# Altium project MiniPC MB GOST.PrjPcb (part 29 of 31)
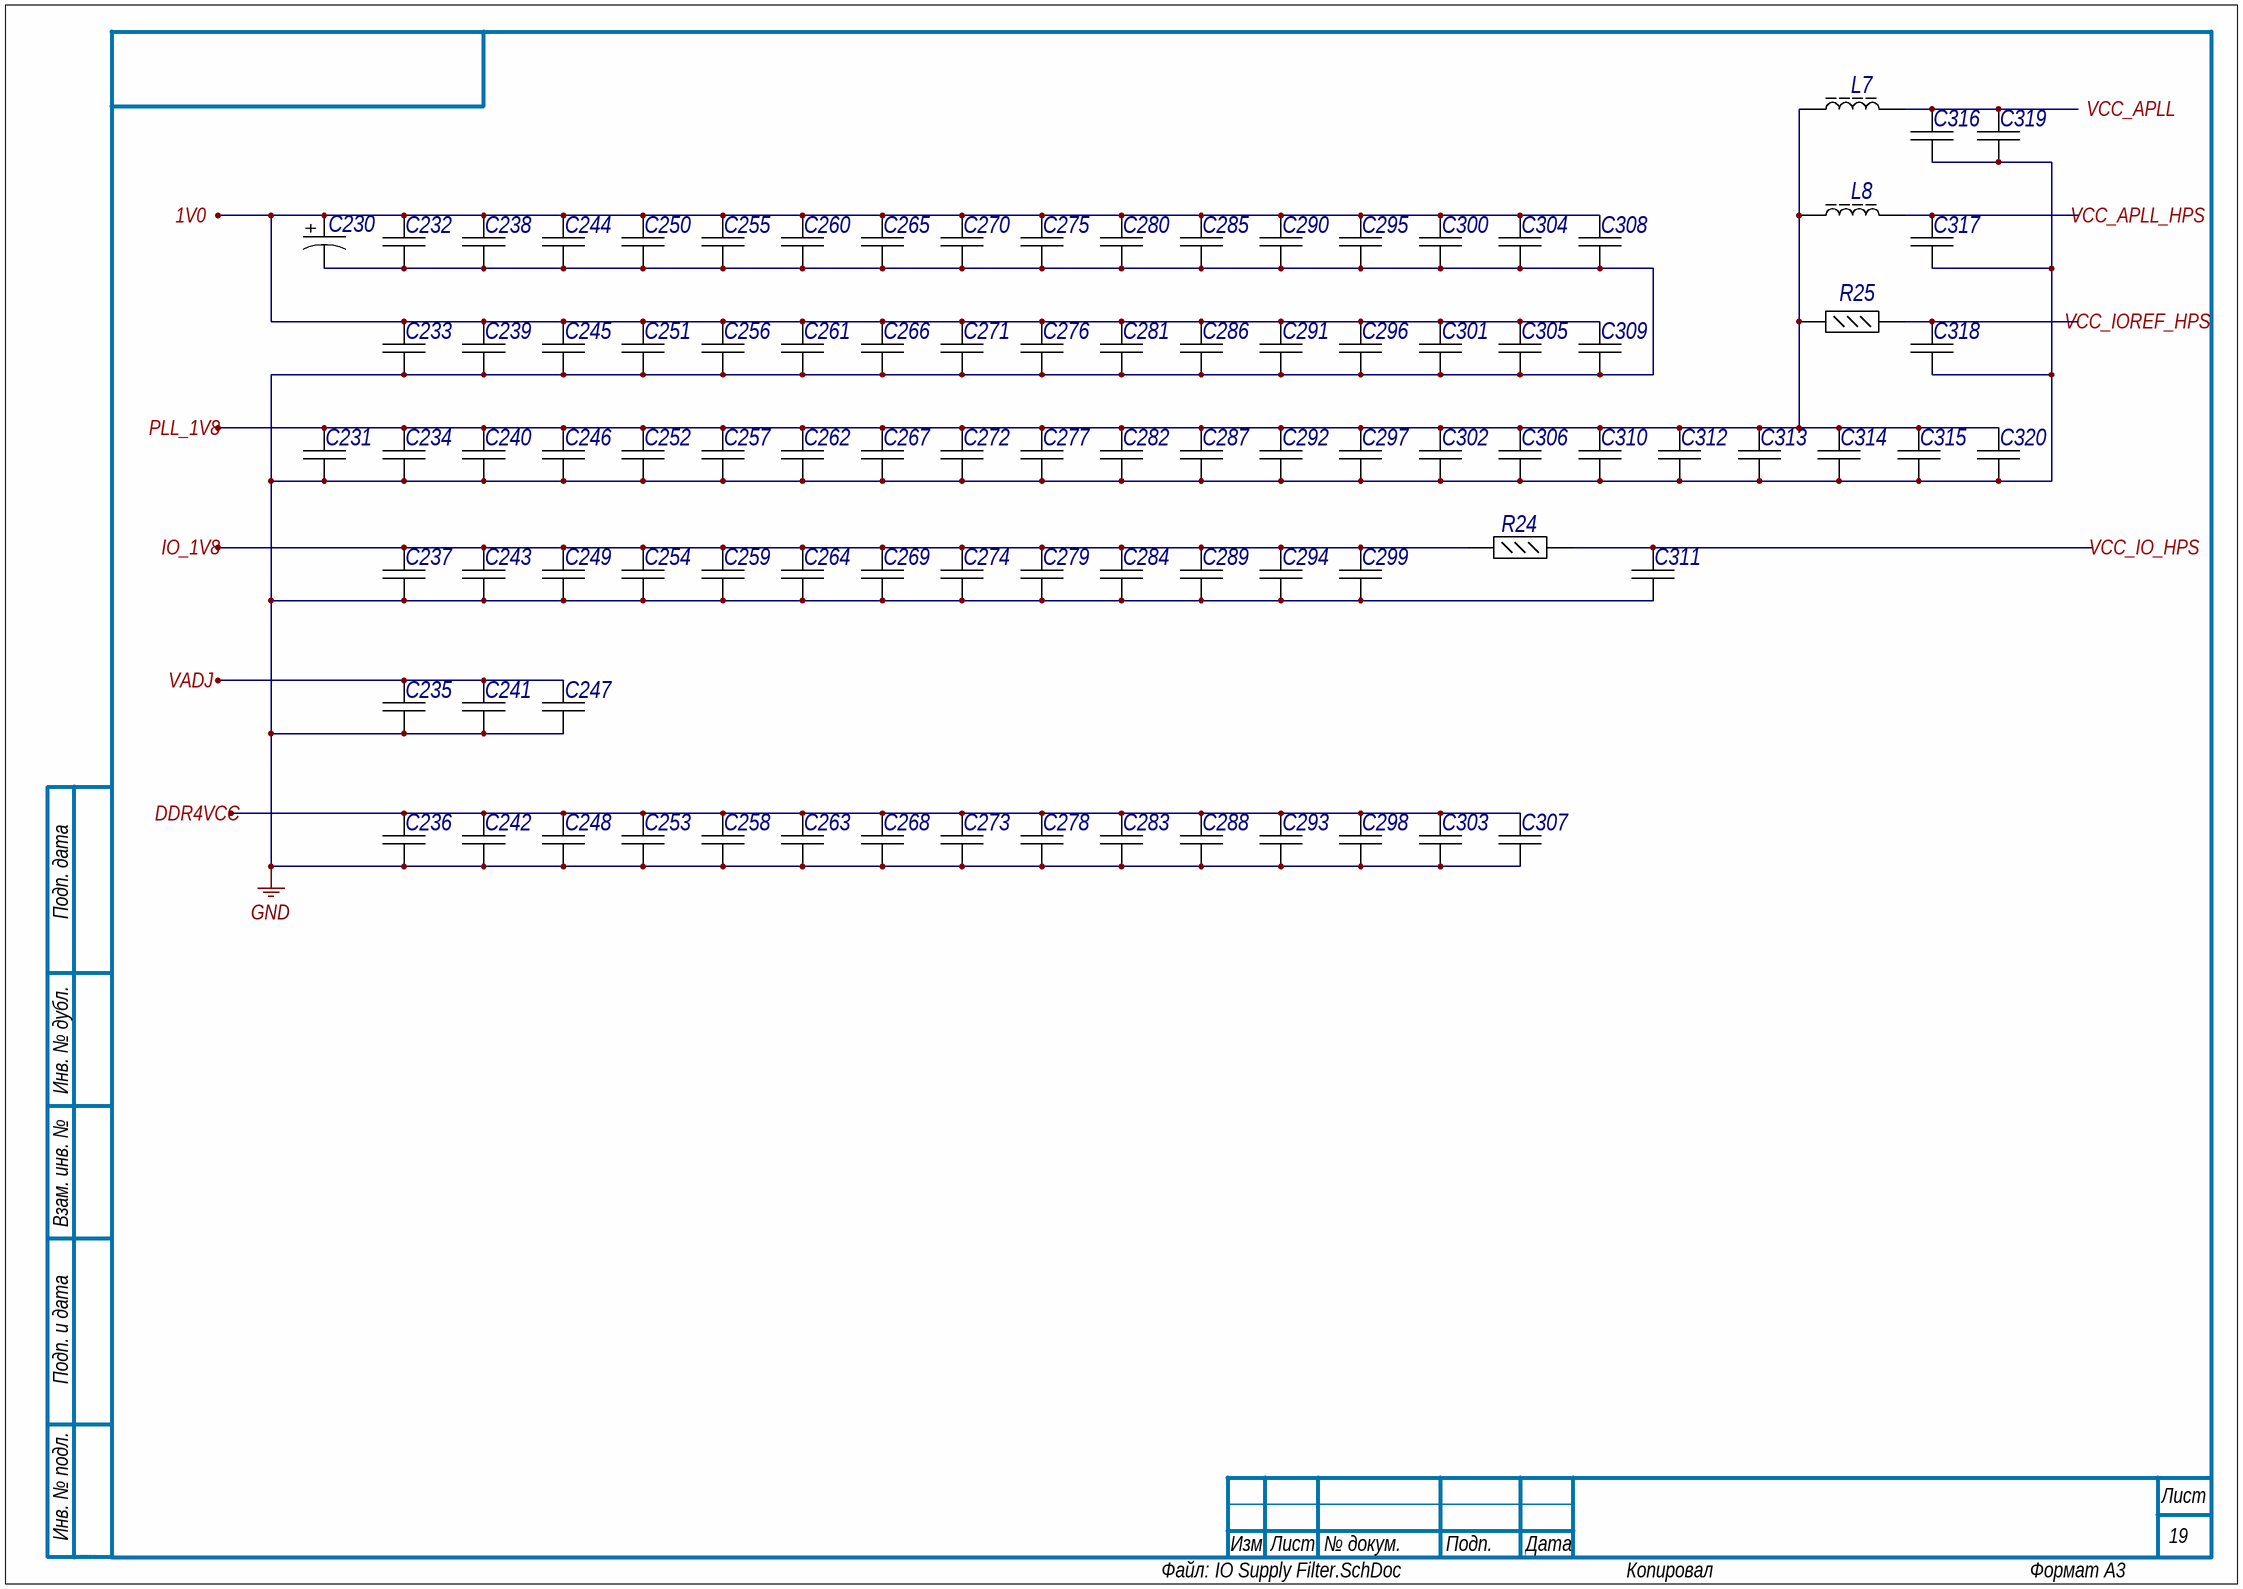
[diagram p56: IO Supply Filter.SchDoc]

## Sheet IO Supply Filter.SchDoc (continued)

### Library data of the parts (continued)
C275 = E22: Chip Capacitor, 100 nF, +/- 10%, 6.3 V, -55 to 85 degC, 0201 (0603 Metric), RoHS, Tape and Reel; Manufacturer: Basic Passives; Тип элемента: Конденсатор; Capacitance: 100 nF; Case\/Package: 0201; Type (Capacitors): X5R; Voltage Rating: 6.3 V; Voltage Rating (DC): 3 V; Old_des: C399; New_des: C275; UID: E22; Component Kind: Standard; Case Code (Imperial): 0201; Case Code (Metric): 0603; ComponentLink1Description: Manufacturer URL; ComponentLink1URL: http://www.murata.com/; ComponentLink2Description: Datasheet; ComponentLink2URL: http://search.murata.co.jp/Ceramy/image/img/A01X/G101/ENG/GRM033R60J104KE19-01.pdf; DatasheetVersion: 03/2016; Length: 0.6 mm; Max Operating Temperature: 85 degC; Min Operating Temperature: -55 degC; Mounting Technology: Surface Mount; Package Quantity: 15000; PackageDescription: 2-Pin Surface Mount Device, Body 0.6 x 0.3 mm; Packaging: Tape and Reel; PartNumber: GRM033R60J104KE19D; RoHSCompliant: true; Tolerance: 10%; Width: 0.3 mm; Height: 0.3 mm; Mount: Surface Mount; PackageReference: 0201; Pins: 2; Radiation Hardening: No; REACH SVHC: No SVHC
C276 = E27: Chip Capacitor, 4.7 uF, +/- 20%, 6.3 V, -55 to 85 degC, 0402 (1005 Metric), RoHS, Tape and Reel; Manufacturer: Basic Passives; Тип элемента: Конденсатор; Capacitance: 4.7 uF; Case\/Package: 0402; Type (Capacitors): X5R; Voltage Rating: 6.3 V; Old_des: C415; New_des: C276; UID: E27; Component Kind: Standard; Case Code (Imperial): 0402; Case Code (Metric): 1005; ComponentLink1Description: Manufacturer URL; ComponentLink1URL: http://www.murata.com/; ComponentLink2Description: Datasheet; ComponentLink2URL: http://search.murata.co.jp/Ceramy/image/img/A01X/G101/ENG/GRM155R60J475ME87-01.pdf; DatasheetVersion: 03/2016; Length: 0.039 inch; Max Operating Temperature: 85 degC; Min Operating Temperature: -55 degC; Mounting Technology: Surface Mount; Package Quantity: 1; PackageDescription: 2-Pin Surface Mount Device, Body 1 x 0.5 mm; Packaging: Tape and Reel; PartNumber: GRM155R60J475ME87D; RoHSCompliant: true; Tolerance: 20%; Width: 0.02 inch; Height: 0.5 mm; Mount: Surface Mount; PackageReference: 0402; Pins: 2; Radiation Hardening: No; REACH SVHC: No SVHC; Voltage Rating (DC): 6.3 V
C277 = E22: Chip Capacitor, 100 nF, +/- 10%, 6.3 V, -55 to 85 degC, 0201 (0603 Metric), RoHS, Tape and Reel; Manufacturer: Basic Passives; Тип элемента: Конденсатор; Capacitance: 100 nF; Case\/Package: 0201; Type (Capacitors): X5R; Voltage Rating: 6.3 V; Voltage Rating (DC): 3 V; Old_des: C432; New_des: C277; UID: E22; Component Kind: Standard; Case Code (Imperial): 0201; Case Code (Metric): 0603; ComponentLink1Description: Manufacturer URL; ComponentLink1URL: http://www.murata.com/; ComponentLink2Description: Datasheet; ComponentLink2URL: http://search.murata.co.jp/Ceramy/image/img/A01X/G101/ENG/GRM033R60J104KE19-01.pdf; DatasheetVersion: 03/2016; Length: 0.6 mm; Max Operating Temperature: 85 degC; Min Operating Temperature: -55 degC; Mounting Technology: Surface Mount; Package Quantity: 15000; PackageDescription: 2-Pin Surface Mount Device, Body 0.6 x 0.3 mm; Packaging: Tape and Reel; PartNumber: GRM033R60J104KE19D; RoHSCompliant: true; Tolerance: 10%; Width: 0.3 mm; Height: 0.3 mm; Mount: Surface Mount; PackageReference: 0201; Pins: 2; Radiation Hardening: No; REACH SVHC: No SVHC
C278 = E22: Chip Capacitor, 100 nF, +/- 10%, 6.3 V, -55 to 85 degC, 0201 (0603 Metric), RoHS, Tape and Reel; Manufacturer: Basic Passives; Тип элемента: Конденсатор; Capacitance: 100 nF; Case\/Package: 0201; Type (Capacitors): X5R; Voltage Rating: 6.3 V; Voltage Rating (DC): 3 V; Old_des: C473; New_des: C278; UID: E22; Component Kind: Standard; Case Code (Imperial): 0201; Case Code (Metric): 0603; ComponentLink1Description: Manufacturer URL; ComponentLink1URL: http://www.murata.com/; ComponentLink2Description: Datasheet; ComponentLink2URL: http://search.murata.co.jp/Ceramy/image/img/A01X/G101/ENG/GRM033R60J104KE19-01.pdf; DatasheetVersion: 03/2016; Length: 0.6 mm; Max Operating Temperature: 85 degC; Min Operating Temperature: -55 degC; Mounting Technology: Surface Mount; Package Quantity: 15000; PackageDescription: 2-Pin Surface Mount Device, Body 0.6 x 0.3 mm; Packaging: Tape and Reel; PartNumber: GRM033R60J104KE19D; RoHSCompliant: true; Tolerance: 10%; Width: 0.3 mm; Height: 0.3 mm; Mount: Surface Mount; PackageReference: 0201; Pins: 2; Radiation Hardening: No; REACH SVHC: No SVHC
C279 = E22: Chip Capacitor, 100 nF, +/- 10%, 6.3 V, -55 to 85 degC, 0201 (0603 Metric), RoHS, Tape and Reel; Manufacturer: Basic Passives; Тип элемента: Конденсатор; Capacitance: 100 nF; Case\/Package: 0201; Type (Capacitors): X5R; Voltage Rating: 6.3 V; Voltage Rating (DC): 3 V; Old_des: C453; New_des: C279; UID: E22; Component Kind: Standard; Case Code (Imperial): 0201; Case Code (Metric): 0603; ComponentLink1Description: Manufacturer URL; ComponentLink1URL: http://www.murata.com/; ComponentLink2Description: Datasheet; ComponentLink2URL: http://search.murata.co.jp/Ceramy/image/img/A01X/G101/ENG/GRM033R60J104KE19-01.pdf; DatasheetVersion: 03/2016; Length: 0.6 mm; Max Operating Temperature: 85 degC; Min Operating Temperature: -55 degC; Mounting Technology: Surface Mount; Package Quantity: 15000; PackageDescription: 2-Pin Surface Mount Device, Body 0.6 x 0.3 mm; Packaging: Tape and Reel; PartNumber: GRM033R60J104KE19D; RoHSCompliant: true; Tolerance: 10%; Width: 0.3 mm; Height: 0.3 mm; Mount: Surface Mount; PackageReference: 0201; Pins: 2; Radiation Hardening: No; REACH SVHC: No SVHC
C280 = E22: Chip Capacitor, 100 nF, +/- 10%, 6.3 V, -55 to 85 degC, 0201 (0603 Metric), RoHS, Tape and Reel; Manufacturer: Basic Passives; Тип элемента: Конденсатор; Capacitance: 100 nF; Case\/Package: 0201; Type (Capacitors): X5R; Voltage Rating: 6.3 V; Voltage Rating (DC): 3 V; Old_des: C400; New_des: C280; UID: E22; Component Kind: Standard; Case Code (Imperial): 0201; Case Code (Metric): 0603; ComponentLink1Description: Manufacturer URL; ComponentLink1URL: http://www.murata.com/; ComponentLink2Description: Datasheet; ComponentLink2URL: http://search.murata.co.jp/Ceramy/image/img/A01X/G101/ENG/GRM033R60J104KE19-01.pdf; DatasheetVersion: 03/2016; Length: 0.6 mm; Max Operating Temperature: 85 degC; Min Operating Temperature: -55 degC; Mounting Technology: Surface Mount; Package Quantity: 15000; PackageDescription: 2-Pin Surface Mount Device, Body 0.6 x 0.3 mm; Packaging: Tape and Reel; PartNumber: GRM033R60J104KE19D; RoHSCompliant: true; Tolerance: 10%; Width: 0.3 mm; Height: 0.3 mm; Mount: Surface Mount; PackageReference: 0201; Pins: 2; Radiation Hardening: No; REACH SVHC: No SVHC
C281 = E27: Chip Capacitor, 4.7 uF, +/- 20%, 6.3 V, -55 to 85 degC, 0402 (1005 Metric), RoHS, Tape and Reel; Manufacturer: Basic Passives; Тип элемента: Конденсатор; Capacitance: 4.7 uF; Case\/Package: 0402; Type (Capacitors): X5R; Voltage Rating: 6.3 V; Old_des: C416; New_des: C281; UID: E27; Component Kind: Standard; Case Code (Imperial): 0402; Case Code (Metric): 1005; ComponentLink1Description: Manufacturer URL; ComponentLink1URL: http://www.murata.com/; ComponentLink2Description: Datasheet; ComponentLink2URL: http://search.murata.co.jp/Ceramy/image/img/A01X/G101/ENG/GRM155R60J475ME87-01.pdf; DatasheetVersion: 03/2016; Length: 0.039 inch; Max Operating Temperature: 85 degC; Min Operating Temperature: -55 degC; Mounting Technology: Surface Mount; Package Quantity: 1; PackageDescription: 2-Pin Surface Mount Device, Body 1 x 0.5 mm; Packaging: Tape and Reel; PartNumber: GRM155R60J475ME87D; RoHSCompliant: true; Tolerance: 20%; Width: 0.02 inch; Height: 0.5 mm; Mount: Surface Mount; PackageReference: 0402; Pins: 2; Radiation Hardening: No; REACH SVHC: No SVHC; Voltage Rating (DC): 6.3 V
C282 = E22: Chip Capacitor, 100 nF, +/- 10%, 6.3 V, -55 to 85 degC, 0201 (0603 Metric), RoHS, Tape and Reel; Manufacturer: Basic Passives; Тип элемента: Конденсатор; Capacitance: 100 nF; Case\/Package: 0201; Type (Capacitors): X5R; Voltage Rating: 6.3 V; Voltage Rating (DC): 3 V; Old_des: C433; New_des: C282; UID: E22; Component Kind: Standard; Case Code (Imperial): 0201; Case Code (Metric): 0603; ComponentLink1Description: Manufacturer URL; ComponentLink1URL: http://www.murata.com/; ComponentLink2Description: Datasheet; ComponentLink2URL: http://search.murata.co.jp/Ceramy/image/img/A01X/G101/ENG/GRM033R60J104KE19-01.pdf; DatasheetVersion: 03/2016; Length: 0.6 mm; Max Operating Temperature: 85 degC; Min Operating Temperature: -55 degC; Mounting Technology: Surface Mount; Package Quantity: 15000; PackageDescription: 2-Pin Surface Mount Device, Body 0.6 x 0.3 mm; Packaging: Tape and Reel; PartNumber: GRM033R60J104KE19D; RoHSCompliant: true; Tolerance: 10%; Width: 0.3 mm; Height: 0.3 mm; Mount: Surface Mount; PackageReference: 0201; Pins: 2; Radiation Hardening: No; REACH SVHC: No SVHC
C283 = E22: Chip Capacitor, 100 nF, +/- 10%, 6.3 V, -55 to 85 degC, 0201 (0603 Metric), RoHS, Tape and Reel; Manufacturer: Basic Passives; Тип элемента: Конденсатор; Capacitance: 100 nF; Case\/Package: 0201; Type (Capacitors): X5R; Voltage Rating: 6.3 V; Voltage Rating (DC): 3 V; Old_des: C474; New_des: C283; UID: E22; Component Kind: Standard; Case Code (Imperial): 0201; Case Code (Metric): 0603; ComponentLink1Description: Manufacturer URL; ComponentLink1URL: http://www.murata.com/; ComponentLink2Description: Datasheet; ComponentLink2URL: http://search.murata.co.jp/Ceramy/image/img/A01X/G101/ENG/GRM033R60J104KE19-01.pdf; DatasheetVersion: 03/2016; Length: 0.6 mm; Max Operating Temperature: 85 degC; Min Operating Temperature: -55 degC; Mounting Technology: Surface Mount; Package Quantity: 15000; PackageDescription: 2-Pin Surface Mount Device, Body 0.6 x 0.3 mm; Packaging: Tape and Reel; PartNumber: GRM033R60J104KE19D; RoHSCompliant: true; Tolerance: 10%; Width: 0.3 mm; Height: 0.3 mm; Mount: Surface Mount; PackageReference: 0201; Pins: 2; Radiation Hardening: No; REACH SVHC: No SVHC
C284 = E22: Chip Capacitor, 100 nF, +/- 10%, 6.3 V, -55 to 85 degC, 0201 (0603 Metric), RoHS, Tape and Reel; Manufacturer: Basic Passives; Тип элемента: Конденсатор; Capacitance: 100 nF; Case\/Package: 0201; Type (Capacitors): X5R; Voltage Rating: 6.3 V; Voltage Rating (DC): 3 V; Old_des: C454; New_des: C284; UID: E22; Component Kind: Standard; Case Code (Imperial): 0201; Case Code (Metric): 0603; ComponentLink1Description: Manufacturer URL; ComponentLink1URL: http://www.murata.com/; ComponentLink2Description: Datasheet; ComponentLink2URL: http://search.murata.co.jp/Ceramy/image/img/A01X/G101/ENG/GRM033R60J104KE19-01.pdf; DatasheetVersion: 03/2016; Length: 0.6 mm; Max Operating Temperature: 85 degC; Min Operating Temperature: -55 degC; Mounting Technology: Surface Mount; Package Quantity: 15000; PackageDescription: 2-Pin Surface Mount Device, Body 0.6 x 0.3 mm; Packaging: Tape and Reel; PartNumber: GRM033R60J104KE19D; RoHSCompliant: true; Tolerance: 10%; Width: 0.3 mm; Height: 0.3 mm; Mount: Surface Mount; PackageReference: 0201; Pins: 2; Radiation Hardening: No; REACH SVHC: No SVHC
C285 = E22: Chip Capacitor, 100 nF, +/- 10%, 6.3 V, -55 to 85 degC, 0201 (0603 Metric), RoHS, Tape and Reel; Manufacturer: Basic Passives; Тип элемента: Конденсатор; Capacitance: 100 nF; Case\/Package: 0201; Type (Capacitors): X5R; Voltage Rating: 6.3 V; Voltage Rating (DC): 3 V; Old_des: C401; New_des: C285; UID: E22; Component Kind: Standard; Case Code (Imperial): 0201; Case Code (Metric): 0603; ComponentLink1Description: Manufacturer URL; ComponentLink1URL: http://www.murata.com/; ComponentLink2Description: Datasheet; ComponentLink2URL: http://search.murata.co.jp/Ceramy/image/img/A01X/G101/ENG/GRM033R60J104KE19-01.pdf; DatasheetVersion: 03/2016; Length: 0.6 mm; Max Operating Temperature: 85 degC; Min Operating Temperature: -55 degC; Mounting Technology: Surface Mount; Package Quantity: 15000; PackageDescription: 2-Pin Surface Mount Device, Body 0.6 x 0.3 mm; Packaging: Tape and Reel; PartNumber: GRM033R60J104KE19D; RoHSCompliant: true; Tolerance: 10%; Width: 0.3 mm; Height: 0.3 mm; Mount: Surface Mount; PackageReference: 0201; Pins: 2; Radiation Hardening: No; REACH SVHC: No SVHC
C286 = E27: Chip Capacitor, 4.7 uF, +/- 20%, 6.3 V, -55 to 85 degC, 0402 (1005 Metric), RoHS, Tape and Reel; Manufacturer: Basic Passives; Тип элемента: Конденсатор; Capacitance: 4.7 uF; Case\/Package: 0402; Type (Capacitors): X5R; Voltage Rating: 6.3 V; Old_des: C417; New_des: C286; UID: E27; Component Kind: Standard; Case Code (Imperial): 0402; Case Code (Metric): 1005; ComponentLink1Description: Manufacturer URL; ComponentLink1URL: http://www.murata.com/; ComponentLink2Description: Datasheet; ComponentLink2URL: http://search.murata.co.jp/Ceramy/image/img/A01X/G101/ENG/GRM155R60J475ME87-01.pdf; DatasheetVersion: 03/2016; Length: 0.039 inch; Max Operating Temperature: 85 degC; Min Operating Temperature: -55 degC; Mounting Technology: Surface Mount; Package Quantity: 1; PackageDescription: 2-Pin Surface Mount Device, Body 1 x 0.5 mm; Packaging: Tape and Reel; PartNumber: GRM155R60J475ME87D; RoHSCompliant: true; Tolerance: 20%; Width: 0.02 inch; Height: 0.5 mm; Mount: Surface Mount; PackageReference: 0402; Pins: 2; Radiation Hardening: No; REACH SVHC: No SVHC; Voltage Rating (DC): 6.3 V
C287 = E22: Chip Capacitor, 100 nF, +/- 10%, 6.3 V, -55 to 85 degC, 0201 (0603 Metric), RoHS, Tape and Reel; Manufacturer: Basic Passives; Тип элемента: Конденсатор; Capacitance: 100 nF; Case\/Package: 0201; Type (Capacitors): X5R; Voltage Rating: 6.3 V; Voltage Rating (DC): 3 V; Old_des: C434; New_des: C287; UID: E22; Component Kind: Standard; Case Code (Imperial): 0201; Case Code (Metric): 0603; ComponentLink1Description: Manufacturer URL; ComponentLink1URL: http://www.murata.com/; ComponentLink2Description: Datasheet; ComponentLink2URL: http://search.murata.co.jp/Ceramy/image/img/A01X/G101/ENG/GRM033R60J104KE19-01.pdf; DatasheetVersion: 03/2016; Length: 0.6 mm; Max Operating Temperature: 85 degC; Min Operating Temperature: -55 degC; Mounting Technology: Surface Mount; Package Quantity: 15000; PackageDescription: 2-Pin Surface Mount Device, Body 0.6 x 0.3 mm; Packaging: Tape and Reel; PartNumber: GRM033R60J104KE19D; RoHSCompliant: true; Tolerance: 10%; Width: 0.3 mm; Height: 0.3 mm; Mount: Surface Mount; PackageReference: 0201; Pins: 2; Radiation Hardening: No; REACH SVHC: No SVHC
C288 = E22: Chip Capacitor, 100 nF, +/- 10%, 6.3 V, -55 to 85 degC, 0201 (0603 Metric), RoHS, Tape and Reel; Manufacturer: Basic Passives; Тип элемента: Конденсатор; Capacitance: 100 nF; Case\/Package: 0201; Type (Capacitors): X5R; Voltage Rating: 6.3 V; Voltage Rating (DC): 3 V; Old_des: C475; New_des: C288; UID: E22; Component Kind: Standard; Case Code (Imperial): 0201; Case Code (Metric): 0603; ComponentLink1Description: Manufacturer URL; ComponentLink1URL: http://www.murata.com/; ComponentLink2Description: Datasheet; ComponentLink2URL: http://search.murata.co.jp/Ceramy/image/img/A01X/G101/ENG/GRM033R60J104KE19-01.pdf; DatasheetVersion: 03/2016; Length: 0.6 mm; Max Operating Temperature: 85 degC; Min Operating Temperature: -55 degC; Mounting Technology: Surface Mount; Package Quantity: 15000; PackageDescription: 2-Pin Surface Mount Device, Body 0.6 x 0.3 mm; Packaging: Tape and Reel; PartNumber: GRM033R60J104KE19D; RoHSCompliant: true; Tolerance: 10%; Width: 0.3 mm; Height: 0.3 mm; Mount: Surface Mount; PackageReference: 0201; Pins: 2; Radiation Hardening: No; REACH SVHC: No SVHC
C289 = E22: Chip Capacitor, 100 nF, +/- 10%, 6.3 V, -55 to 85 degC, 0201 (0603 Metric), RoHS, Tape and Reel; Manufacturer: Basic Passives; Тип элемента: Конденсатор; Capacitance: 100 nF; Case\/Package: 0201; Type (Capacitors): X5R; Voltage Rating: 6.3 V; Voltage Rating (DC): 3 V; Old_des: C455; New_des: C289; UID: E22; Component Kind: Standard; Case Code (Imperial): 0201; Case Code (Metric): 0603; ComponentLink1Description: Manufacturer URL; ComponentLink1URL: http://www.murata.com/; ComponentLink2Description: Datasheet; ComponentLink2URL: http://search.murata.co.jp/Ceramy/image/img/A01X/G101/ENG/GRM033R60J104KE19-01.pdf; DatasheetVersion: 03/2016; Length: 0.6 mm; Max Operating Temperature: 85 degC; Min Operating Temperature: -55 degC; Mounting Technology: Surface Mount; Package Quantity: 15000; PackageDescription: 2-Pin Surface Mount Device, Body 0.6 x 0.3 mm; Packaging: Tape and Reel; PartNumber: GRM033R60J104KE19D; RoHSCompliant: true; Tolerance: 10%; Width: 0.3 mm; Height: 0.3 mm; Mount: Surface Mount; PackageReference: 0201; Pins: 2; Radiation Hardening: No; REACH SVHC: No SVHC
C290 = E22: Chip Capacitor, 100 nF, +/- 10%, 6.3 V, -55 to 85 degC, 0201 (0603 Metric), RoHS, Tape and Reel; Manufacturer: Basic Passives; Тип элемента: Конденсатор; Capacitance: 100 nF; Case\/Package: 0201; Type (Capacitors): X5R; Voltage Rating: 6.3 V; Voltage Rating (DC): 3 V; Old_des: C402; New_des: C290; UID: E22; Component Kind: Standard; Case Code (Imperial): 0201; Case Code (Metric): 0603; ComponentLink1Description: Manufacturer URL; ComponentLink1URL: http://www.murata.com/; ComponentLink2Description: Datasheet; ComponentLink2URL: http://search.murata.co.jp/Ceramy/image/img/A01X/G101/ENG/GRM033R60J104KE19-01.pdf; DatasheetVersion: 03/2016; Length: 0.6 mm; Max Operating Temperature: 85 degC; Min Operating Temperature: -55 degC; Mounting Technology: Surface Mount; Package Quantity: 15000; PackageDescription: 2-Pin Surface Mount Device, Body 0.6 x 0.3 mm; Packaging: Tape and Reel; PartNumber: GRM033R60J104KE19D; RoHSCompliant: true; Tolerance: 10%; Width: 0.3 mm; Height: 0.3 mm; Mount: Surface Mount; PackageReference: 0201; Pins: 2; Radiation Hardening: No; REACH SVHC: No SVHC
C291 = E27: Chip Capacitor, 4.7 uF, +/- 20%, 6.3 V, -55 to 85 degC, 0402 (1005 Metric), RoHS, Tape and Reel; Manufacturer: Basic Passives; Тип элемента: Конденсатор; Capacitance: 4.7 uF; Case\/Package: 0402; Type (Capacitors): X5R; Voltage Rating: 6.3 V; Old_des: C418; New_des: C291; UID: E27; Component Kind: Standard; Case Code (Imperial): 0402; Case Code (Metric): 1005; ComponentLink1Description: Manufacturer URL; ComponentLink1URL: http://www.murata.com/; ComponentLink2Description: Datasheet; ComponentLink2URL: http://search.murata.co.jp/Ceramy/image/img/A01X/G101/ENG/GRM155R60J475ME87-01.pdf; DatasheetVersion: 03/2016; Length: 0.039 inch; Max Operating Temperature: 85 degC; Min Operating Temperature: -55 degC; Mounting Technology: Surface Mount; Package Quantity: 1; PackageDescription: 2-Pin Surface Mount Device, Body 1 x 0.5 mm; Packaging: Tape and Reel; PartNumber: GRM155R60J475ME87D; RoHSCompliant: true; Tolerance: 20%; Width: 0.02 inch; Height: 0.5 mm; Mount: Surface Mount; PackageReference: 0402; Pins: 2; Radiation Hardening: No; REACH SVHC: No SVHC; Voltage Rating (DC): 6.3 V
C292 = E22: Chip Capacitor, 100 nF, +/- 10%, 6.3 V, -55 to 85 degC, 0201 (0603 Metric), RoHS, Tape and Reel; Manufacturer: Basic Passives; Тип элемента: Конденсатор; Capacitance: 100 nF; Case\/Package: 0201; Type (Capacitors): X5R; Voltage Rating: 6.3 V; Voltage Rating (DC): 3 V; Old_des: C435; New_des: C292; UID: E22; Component Kind: Standard; Case Code (Imperial): 0201; Case Code (Metric): 0603; ComponentLink1Description: Manufacturer URL; ComponentLink1URL: http://www.murata.com/; ComponentLink2Description: Datasheet; ComponentLink2URL: http://search.murata.co.jp/Ceramy/image/img/A01X/G101/ENG/GRM033R60J104KE19-01.pdf; DatasheetVersion: 03/2016; Length: 0.6 mm; Max Operating Temperature: 85 degC; Min Operating Temperature: -55 degC; Mounting Technology: Surface Mount; Package Quantity: 15000; PackageDescription: 2-Pin Surface Mount Device, Body 0.6 x 0.3 mm; Packaging: Tape and Reel; PartNumber: GRM033R60J104KE19D; RoHSCompliant: true; Tolerance: 10%; Width: 0.3 mm; Height: 0.3 mm; Mount: Surface Mount; PackageReference: 0201; Pins: 2; Radiation Hardening: No; REACH SVHC: No SVHC
C293 = E22: Chip Capacitor, 100 nF, +/- 10%, 6.3 V, -55 to 85 degC, 0201 (0603 Metric), RoHS, Tape and Reel; Manufacturer: Basic Passives; Тип элемента: Конденсатор; Capacitance: 100 nF; Case\/Package: 0201; Type (Capacitors): X5R; Voltage Rating: 6.3 V; Voltage Rating (DC): 3 V; Old_des: C476; New_des: C293; UID: E22; Component Kind: Standard; Case Code (Imperial): 0201; Case Code (Metric): 0603; ComponentLink1Description: Manufacturer URL; ComponentLink1URL: http://www.murata.com/; ComponentLink2Description: Datasheet; ComponentLink2URL: http://search.murata.co.jp/Ceramy/image/img/A01X/G101/ENG/GRM033R60J104KE19-01.pdf; DatasheetVersion: 03/2016; Length: 0.6 mm; Max Operating Temperature: 85 degC; Min Operating Temperature: -55 degC; Mounting Technology: Surface Mount; Package Quantity: 15000; PackageDescription: 2-Pin Surface Mount Device, Body 0.6 x 0.3 mm; Packaging: Tape and Reel; PartNumber: GRM033R60J104KE19D; RoHSCompliant: true; Tolerance: 10%; Width: 0.3 mm; Height: 0.3 mm; Mount: Surface Mount; PackageReference: 0201; Pins: 2; Radiation Hardening: No; REACH SVHC: No SVHC
C294 = E22: Chip Capacitor, 100 nF, +/- 10%, 6.3 V, -55 to 85 degC, 0201 (0603 Metric), RoHS, Tape and Reel; Manufacturer: Basic Passives; Тип элемента: Конденсатор; Capacitance: 100 nF; Case\/Package: 0201; Type (Capacitors): X5R; Voltage Rating: 6.3 V; Voltage Rating (DC): 3 V; Old_des: C456; New_des: C294; UID: E22; Component Kind: Standard; Case Code (Imperial): 0201; Case Code (Metric): 0603; ComponentLink1Description: Manufacturer URL; ComponentLink1URL: http://www.murata.com/; ComponentLink2Description: Datasheet; ComponentLink2URL: http://search.murata.co.jp/Ceramy/image/img/A01X/G101/ENG/GRM033R60J104KE19-01.pdf; DatasheetVersion: 03/2016; Length: 0.6 mm; Max Operating Temperature: 85 degC; Min Operating Temperature: -55 degC; Mounting Technology: Surface Mount; Package Quantity: 15000; PackageDescription: 2-Pin Surface Mount Device, Body 0.6 x 0.3 mm; Packaging: Tape and Reel; PartNumber: GRM033R60J104KE19D; RoHSCompliant: true; Tolerance: 10%; Width: 0.3 mm; Height: 0.3 mm; Mount: Surface Mount; PackageReference: 0201; Pins: 2; Radiation Hardening: No; REACH SVHC: No SVHC
C295 = E22: Chip Capacitor, 100 nF, +/- 10%, 6.3 V, -55 to 85 degC, 0201 (0603 Metric), RoHS, Tape and Reel; Manufacturer: Basic Passives; Тип элемента: Конденсатор; Capacitance: 100 nF; Case\/Package: 0201; Type (Capacitors): X5R; Voltage Rating: 6.3 V; Voltage Rating (DC): 3 V; Old_des: C403; New_des: C295; UID: E22; Component Kind: Standard; Case Code (Imperial): 0201; Case Code (Metric): 0603; ComponentLink1Description: Manufacturer URL; ComponentLink1URL: http://www.murata.com/; ComponentLink2Description: Datasheet; ComponentLink2URL: http://search.murata.co.jp/Ceramy/image/img/A01X/G101/ENG/GRM033R60J104KE19-01.pdf; DatasheetVersion: 03/2016; Length: 0.6 mm; Max Operating Temperature: 85 degC; Min Operating Temperature: -55 degC; Mounting Technology: Surface Mount; Package Quantity: 15000; PackageDescription: 2-Pin Surface Mount Device, Body 0.6 x 0.3 mm; Packaging: Tape and Reel; PartNumber: GRM033R60J104KE19D; RoHSCompliant: true; Tolerance: 10%; Width: 0.3 mm; Height: 0.3 mm; Mount: Surface Mount; PackageReference: 0201; Pins: 2; Radiation Hardening: No; REACH SVHC: No SVHC
C296 = E27: Chip Capacitor, 4.7 uF, +/- 20%, 6.3 V, -55 to 85 degC, 0402 (1005 Metric), RoHS, Tape and Reel; Manufacturer: Basic Passives; Тип элемента: Конденсатор; Capacitance: 4.7 uF; Case\/Package: 0402; Type (Capacitors): X5R; Voltage Rating: 6.3 V; Old_des: C419; New_des: C296; UID: E27; Component Kind: Standard; Case Code (Imperial): 0402; Case Code (Metric): 1005; ComponentLink1Description: Manufacturer URL; ComponentLink1URL: http://www.murata.com/; ComponentLink2Description: Datasheet; ComponentLink2URL: http://search.murata.co.jp/Ceramy/image/img/A01X/G101/ENG/GRM155R60J475ME87-01.pdf; DatasheetVersion: 03/2016; Length: 0.039 inch; Max Operating Temperature: 85 degC; Min Operating Temperature: -55 degC; Mounting Technology: Surface Mount; Package Quantity: 1; PackageDescription: 2-Pin Surface Mount Device, Body 1 x 0.5 mm; Packaging: Tape and Reel; PartNumber: GRM155R60J475ME87D; RoHSCompliant: true; Tolerance: 20%; Width: 0.02 inch; Height: 0.5 mm; Mount: Surface Mount; PackageReference: 0402; Pins: 2; Radiation Hardening: No; REACH SVHC: No SVHC; Voltage Rating (DC): 6.3 V
C297 = E22: Chip Capacitor, 100 nF, +/- 10%, 6.3 V, -55 to 85 degC, 0201 (0603 Metric), RoHS, Tape and Reel; Manufacturer: Basic Passives; Тип элемента: Конденсатор; Capacitance: 100 nF; Case\/Package: 0201; Type (Capacitors): X5R; Voltage Rating: 6.3 V; Voltage Rating (DC): 3 V; Old_des: C436; New_des: C297; UID: E22; Component Kind: Standard; Case Code (Imperial): 0201; Case Code (Metric): 0603; ComponentLink1Description: Manufacturer URL; ComponentLink1URL: http://www.murata.com/; ComponentLink2Description: Datasheet; ComponentLink2URL: http://search.murata.co.jp/Ceramy/image/img/A01X/G101/ENG/GRM033R60J104KE19-01.pdf; DatasheetVersion: 03/2016; Length: 0.6 mm; Max Operating Temperature: 85 degC; Min Operating Temperature: -55 degC; Mounting Technology: Surface Mount; Package Quantity: 15000; PackageDescription: 2-Pin Surface Mount Device, Body 0.6 x 0.3 mm; Packaging: Tape and Reel; PartNumber: GRM033R60J104KE19D; RoHSCompliant: true; Tolerance: 10%; Width: 0.3 mm; Height: 0.3 mm; Mount: Surface Mount; PackageReference: 0201; Pins: 2; Radiation Hardening: No; REACH SVHC: No SVHC
C298 = E22: Chip Capacitor, 100 nF, +/- 10%, 6.3 V, -55 to 85 degC, 0201 (0603 Metric), RoHS, Tape and Reel; Manufacturer: Basic Passives; Тип элемента: Конденсатор; Capacitance: 100 nF; Case\/Package: 0201; Type (Capacitors): X5R; Voltage Rating: 6.3 V; Voltage Rating (DC): 3 V; Old_des: C477; New_des: C298; UID: E22; Component Kind: Standard; Case Code (Imperial): 0201; Case Code (Metric): 0603; ComponentLink1Description: Manufacturer URL; ComponentLink1URL: http://www.murata.com/; ComponentLink2Description: Datasheet; ComponentLink2URL: http://search.murata.co.jp/Ceramy/image/img/A01X/G101/ENG/GRM033R60J104KE19-01.pdf; DatasheetVersion: 03/2016; Length: 0.6 mm; Max Operating Temperature: 85 degC; Min Operating Temperature: -55 degC; Mounting Technology: Surface Mount; Package Quantity: 15000; PackageDescription: 2-Pin Surface Mount Device, Body 0.6 x 0.3 mm; Packaging: Tape and Reel; PartNumber: GRM033R60J104KE19D; RoHSCompliant: true; Tolerance: 10%; Width: 0.3 mm; Height: 0.3 mm; Mount: Surface Mount; PackageReference: 0201; Pins: 2; Radiation Hardening: No; REACH SVHC: No SVHC
C299 = E22: Chip Capacitor, 100 nF, +/- 10%, 6.3 V, -55 to 85 degC, 0201 (0603 Metric), RoHS, Tape and Reel; Manufacturer: Basic Passives; Тип элемента: Конденсатор; Capacitance: 100 nF; Case\/Package: 0201; Type (Capacitors): X5R; Voltage Rating: 6.3 V; Voltage Rating (DC): 3 V; Old_des: C457; New_des: C299; UID: E22; Component Kind: Standard; Case Code (Imperial): 0201; Case Code (Metric): 0603; ComponentLink1Description: Manufacturer URL; ComponentLink1URL: http://www.murata.com/; ComponentLink2Description: Datasheet; ComponentLink2URL: http://search.murata.co.jp/Ceramy/image/img/A01X/G101/ENG/GRM033R60J104KE19-01.pdf; DatasheetVersion: 03/2016; Length: 0.6 mm; Max Operating Temperature: 85 degC; Min Operating Temperature: -55 degC; Mounting Technology: Surface Mount; Package Quantity: 15000; PackageDescription: 2-Pin Surface Mount Device, Body 0.6 x 0.3 mm; Packaging: Tape and Reel; PartNumber: GRM033R60J104KE19D; RoHSCompliant: true; Tolerance: 10%; Width: 0.3 mm; Height: 0.3 mm; Mount: Surface Mount; PackageReference: 0201; Pins: 2; Radiation Hardening: No; REACH SVHC: No SVHC
C300 = E22: Chip Capacitor, 100 nF, +/- 10%, 6.3 V, -55 to 85 degC, 0201 (0603 Metric), RoHS, Tape and Reel; Manufacturer: Basic Passives; Тип элемента: Конденсатор; Capacitance: 100 nF; Case\/Package: 0201; Type (Capacitors): X5R; Voltage Rating: 6.3 V; Voltage Rating (DC): 3 V; Old_des: C404; New_des: C300; UID: E22; Component Kind: Standard; Case Code (Imperial): 0201; Case Code (Metric): 0603; ComponentLink1Description: Manufacturer URL; ComponentLink1URL: http://www.murata.com/; ComponentLink2Description: Datasheet; ComponentLink2URL: http://search.murata.co.jp/Ceramy/image/img/A01X/G101/ENG/GRM033R60J104KE19-01.pdf; DatasheetVersion: 03/2016; Length: 0.6 mm; Max Operating Temperature: 85 degC; Min Operating Temperature: -55 degC; Mounting Technology: Surface Mount; Package Quantity: 15000; PackageDescription: 2-Pin Surface Mount Device, Body 0.6 x 0.3 mm; Packaging: Tape and Reel; PartNumber: GRM033R60J104KE19D; RoHSCompliant: true; Tolerance: 10%; Width: 0.3 mm; Height: 0.3 mm; Mount: Surface Mount; PackageReference: 0201; Pins: 2; Radiation Hardening: No; REACH SVHC: No SVHC
C301 = E27: Chip Capacitor, 4.7 uF, +/- 20%, 6.3 V, -55 to 85 degC, 0402 (1005 Metric), RoHS, Tape and Reel; Manufacturer: Basic Passives; Тип элемента: Конденсатор; Capacitance: 4.7 uF; Case\/Package: 0402; Type (Capacitors): X5R; Voltage Rating: 6.3 V; Old_des: C420; New_des: C301; UID: E27; Component Kind: Standard; Case Code (Imperial): 0402; Case Code (Metric): 1005; ComponentLink1Description: Manufacturer URL; ComponentLink1URL: http://www.murata.com/; ComponentLink2Description: Datasheet; ComponentLink2URL: http://search.murata.co.jp/Ceramy/image/img/A01X/G101/ENG/GRM155R60J475ME87-01.pdf; DatasheetVersion: 03/2016; Length: 0.039 inch; Max Operating Temperature: 85 degC; Min Operating Temperature: -55 degC; Mounting Technology: Surface Mount; Package Quantity: 1; PackageDescription: 2-Pin Surface Mount Device, Body 1 x 0.5 mm; Packaging: Tape and Reel; PartNumber: GRM155R60J475ME87D; RoHSCompliant: true; Tolerance: 20%; Width: 0.02 inch; Height: 0.5 mm; Mount: Surface Mount; PackageReference: 0402; Pins: 2; Radiation Hardening: No; REACH SVHC: No SVHC; Voltage Rating (DC): 6.3 V
C302 = E22: Chip Capacitor, 100 nF, +/- 10%, 6.3 V, -55 to 85 degC, 0201 (0603 Metric), RoHS, Tape and Reel; Manufacturer: Basic Passives; Тип элемента: Конденсатор; Capacitance: 100 nF; Case\/Package: 0201; Type (Capacitors): X5R; Voltage Rating: 6.3 V; Voltage Rating (DC): 3 V; Old_des: C437; New_des: C302; UID: E22; Component Kind: Standard; Case Code (Imperial): 0201; Case Code (Metric): 0603; ComponentLink1Description: Manufacturer URL; ComponentLink1URL: http://www.murata.com/; ComponentLink2Description: Datasheet; ComponentLink2URL: http://search.murata.co.jp/Ceramy/image/img/A01X/G101/ENG/GRM033R60J104KE19-01.pdf; DatasheetVersion: 03/2016; Length: 0.6 mm; Max Operating Temperature: 85 degC; Min Operating Temperature: -55 degC; Mounting Technology: Surface Mount; Package Quantity: 15000; PackageDescription: 2-Pin Surface Mount Device, Body 0.6 x 0.3 mm; Packaging: Tape and Reel; PartNumber: GRM033R60J104KE19D; RoHSCompliant: true; Tolerance: 10%; Width: 0.3 mm; Height: 0.3 mm; Mount: Surface Mount; PackageReference: 0201; Pins: 2; Radiation Hardening: No; REACH SVHC: No SVHC
C303 = E22: Chip Capacitor, 100 nF, +/- 10%, 6.3 V, -55 to 85 degC, 0201 (0603 Metric), RoHS, Tape and Reel; Manufacturer: Basic Passives; Тип элемента: Конденсатор; Capacitance: 100 nF; Case\/Package: 0201; Type (Capacitors): X5R; Voltage Rating: 6.3 V; Voltage Rating (DC): 3 V; Old_des: C478; New_des: C303; UID: E22; Component Kind: Standard; Case Code (Imperial): 0201; Case Code (Metric): 0603; ComponentLink1Description: Manufacturer URL; ComponentLink1URL: http://www.murata.com/; ComponentLink2Description: Datasheet; ComponentLink2URL: http://search.murata.co.jp/Ceramy/image/img/A01X/G101/ENG/GRM033R60J104KE19-01.pdf; DatasheetVersion: 03/2016; Length: 0.6 mm; Max Operating Temperature: 85 degC; Min Operating Temperature: -55 degC; Mounting Technology: Surface Mount; Package Quantity: 15000; PackageDescription: 2-Pin Surface Mount Device, Body 0.6 x 0.3 mm; Packaging: Tape and Reel; PartNumber: GRM033R60J104KE19D; RoHSCompliant: true; Tolerance: 10%; Width: 0.3 mm; Height: 0.3 mm; Mount: Surface Mount; PackageReference: 0201; Pins: 2; Radiation Hardening: No; REACH SVHC: No SVHC
C304 = E22: Chip Capacitor, 100 nF, +/- 10%, 6.3 V, -55 to 85 degC, 0201 (0603 Metric), RoHS, Tape and Reel; Manufacturer: Basic Passives; Тип элемента: Конденсатор; Capacitance: 100 nF; Case\/Package: 0201; Type (Capacitors): X5R; Voltage Rating: 6.3 V; Voltage Rating (DC): 3 V; Old_des: C405; New_des: C304; UID: E22; Component Kind: Standard; Case Code (Imperial): 0201; Case Code (Metric): 0603; ComponentLink1Description: Manufacturer URL; ComponentLink1URL: http://www.murata.com/; ComponentLink2Description: Datasheet; ComponentLink2URL: http://search.murata.co.jp/Ceramy/image/img/A01X/G101/ENG/GRM033R60J104KE19-01.pdf; DatasheetVersion: 03/2016; Length: 0.6 mm; Max Operating Temperature: 85 degC; Min Operating Temperature: -55 degC; Mounting Technology: Surface Mount; Package Quantity: 15000; PackageDescription: 2-Pin Surface Mount Device, Body 0.6 x 0.3 mm; Packaging: Tape and Reel; PartNumber: GRM033R60J104KE19D; RoHSCompliant: true; Tolerance: 10%; Width: 0.3 mm; Height: 0.3 mm; Mount: Surface Mount; PackageReference: 0201; Pins: 2; Radiation Hardening: No; REACH SVHC: No SVHC
C305 = E27: Chip Capacitor, 4.7 uF, +/- 20%, 6.3 V, -55 to 85 degC, 0402 (1005 Metric), RoHS, Tape and Reel; Manufacturer: Basic Passives; Тип элемента: Конденсатор; Capacitance: 4.7 uF; Case\/Package: 0402; Type (Capacitors): X5R; Voltage Rating: 6.3 V; Old_des: C421; New_des: C305; UID: E27; Component Kind: Standard; Case Code (Imperial): 0402; Case Code (Metric): 1005; ComponentLink1Description: Manufacturer URL; ComponentLink1URL: http://www.murata.com/; ComponentLink2Description: Datasheet; ComponentLink2URL: http://search.murata.co.jp/Ceramy/image/img/A01X/G101/ENG/GRM155R60J475ME87-01.pdf; DatasheetVersion: 03/2016; Length: 0.039 inch; Max Operating Temperature: 85 degC; Min Operating Temperature: -55 degC; Mounting Technology: Surface Mount; Package Quantity: 1; PackageDescription: 2-Pin Surface Mount Device, Body 1 x 0.5 mm; Packaging: Tape and Reel; PartNumber: GRM155R60J475ME87D; RoHSCompliant: true; Tolerance: 20%; Width: 0.02 inch; Height: 0.5 mm; Mount: Surface Mount; PackageReference: 0402; Pins: 2; Radiation Hardening: No; REACH SVHC: No SVHC; Voltage Rating (DC): 6.3 V
C306 = E22: Chip Capacitor, 100 nF, +/- 10%, 6.3 V, -55 to 85 degC, 0201 (0603 Metric), RoHS, Tape and Reel; Manufacturer: Basic Passives; Тип элемента: Конденсатор; Capacitance: 100 nF; Case\/Package: 0201; Type (Capacitors): X5R; Voltage Rating: 6.3 V; Voltage Rating (DC): 3 V; Old_des: C438; New_des: C306; UID: E22; Component Kind: Standard; Case Code (Imperial): 0201; Case Code (Metric): 0603; ComponentLink1Description: Manufacturer URL; ComponentLink1URL: http://www.murata.com/; ComponentLink2Description: Datasheet; ComponentLink2URL: http://search.murata.co.jp/Ceramy/image/img/A01X/G101/ENG/GRM033R60J104KE19-01.pdf; DatasheetVersion: 03/2016; Length: 0.6 mm; Max Operating Temperature: 85 degC; Min Operating Temperature: -55 degC; Mounting Technology: Surface Mount; Package Quantity: 15000; PackageDescription: 2-Pin Surface Mount Device, Body 0.6 x 0.3 mm; Packaging: Tape and Reel; PartNumber: GRM033R60J104KE19D; RoHSCompliant: true; Tolerance: 10%; Width: 0.3 mm; Height: 0.3 mm; Mount: Surface Mount; PackageReference: 0201; Pins: 2; Radiation Hardening: No; REACH SVHC: No SVHC
C307 = E22: Chip Capacitor, 100 nF, +/- 10%, 6.3 V, -55 to 85 degC, 0201 (0603 Metric), RoHS, Tape and Reel; Manufacturer: Basic Passives; Тип элемента: Конденсатор; Capacitance: 100 nF; Case\/Package: 0201; Type (Capacitors): X5R; Voltage Rating: 6.3 V; Voltage Rating (DC): 3 V; Old_des: C479; New_des: C307; UID: E22; Component Kind: Standard; Case Code (Imperial): 0201; Case Code (Metric): 0603; ComponentLink1Description: Manufacturer URL; ComponentLink1URL: http://www.murata.com/; ComponentLink2Description: Datasheet; ComponentLink2URL: http://search.murata.co.jp/Ceramy/image/img/A01X/G101/ENG/GRM033R60J104KE19-01.pdf; DatasheetVersion: 03/2016; Length: 0.6 mm; Max Operating Temperature: 85 degC; Min Operating Temperature: -55 degC; Mounting Technology: Surface Mount; Package Quantity: 15000; PackageDescription: 2-Pin Surface Mount Device, Body 0.6 x 0.3 mm; Packaging: Tape and Reel; PartNumber: GRM033R60J104KE19D; RoHSCompliant: true; Tolerance: 10%; Width: 0.3 mm; Height: 0.3 mm; Mount: Surface Mount; PackageReference: 0201; Pins: 2; Radiation Hardening: No; REACH SVHC: No SVHC
C308 = E22: Chip Capacitor, 100 nF, +/- 10%, 6.3 V, -55 to 85 degC, 0201 (0603 Metric), RoHS, Tape and Reel; Manufacturer: Basic Passives; Тип элемента: Конденсатор; Capacitance: 100 nF; Case\/Package: 0201; Type (Capacitors): X5R; Voltage Rating: 6.3 V; Voltage Rating (DC): 3 V; Old_des: C406; New_des: C308; UID: E22; Component Kind: Standard; Case Code (Imperial): 0201; Case Code (Metric): 0603; ComponentLink1Description: Manufacturer URL; ComponentLink1URL: http://www.murata.com/; ComponentLink2Description: Datasheet; ComponentLink2URL: http://search.murata.co.jp/Ceramy/image/img/A01X/G101/ENG/GRM033R60J104KE19-01.pdf; DatasheetVersion: 03/2016; Length: 0.6 mm; Max Operating Temperature: 85 degC; Min Operating Temperature: -55 degC; Mounting Technology: Surface Mount; Package Quantity: 15000; PackageDescription: 2-Pin Surface Mount Device, Body 0.6 x 0.3 mm; Packaging: Tape and Reel; PartNumber: GRM033R60J104KE19D; RoHSCompliant: true; Tolerance: 10%; Width: 0.3 mm; Height: 0.3 mm; Mount: Surface Mount; PackageReference: 0201; Pins: 2; Radiation Hardening: No; REACH SVHC: No SVHC
C309 = E27: Chip Capacitor, 4.7 uF, +/- 20%, 6.3 V, -55 to 85 degC, 0402 (1005 Metric), RoHS, Tape and Reel; Manufacturer: Basic Passives; Тип элемента: Конденсатор; Capacitance: 4.7 uF; Case\/Package: 0402; Type (Capacitors): X5R; Voltage Rating: 6.3 V; Old_des: C422; New_des: C309; UID: E27; Component Kind: Standard; Case Code (Imperial): 0402; Case Code (Metric): 1005; ComponentLink1Description: Manufacturer URL; ComponentLink1URL: http://www.murata.com/; ComponentLink2Description: Datasheet; ComponentLink2URL: http://search.murata.co.jp/Ceramy/image/img/A01X/G101/ENG/GRM155R60J475ME87-01.pdf; DatasheetVersion: 03/2016; Length: 0.039 inch; Max Operating Temperature: 85 degC; Min Operating Temperature: -55 degC; Mounting Technology: Surface Mount; Package Quantity: 1; PackageDescription: 2-Pin Surface Mount Device, Body 1 x 0.5 mm; Packaging: Tape and Reel; PartNumber: GRM155R60J475ME87D; RoHSCompliant: true; Tolerance: 20%; Width: 0.02 inch; Height: 0.5 mm; Mount: Surface Mount; PackageReference: 0402; Pins: 2; Radiation Hardening: No; REACH SVHC: No SVHC; Voltage Rating (DC): 6.3 V
C310 = E22: Chip Capacitor, 100 nF, +/- 10%, 6.3 V, -55 to 85 degC, 0201 (0603 Metric), RoHS, Tape and Reel; Manufacturer: Basic Passives; Тип элемента: Конденсатор; Capacitance: 100 nF; Case\/Package: 0201; Type (Capacitors): X5R; Voltage Rating: 6.3 V; Voltage Rating (DC): 3 V; Old_des: C439; New_des: C310; UID: E22; Component Kind: Standard; Case Code (Imperial): 0201; Case Code (Metric): 0603; ComponentLink1Description: Manufacturer URL; ComponentLink1URL: http://www.murata.com/; ComponentLink2Description: Datasheet; ComponentLink2URL: http://search.murata.co.jp/Ceramy/image/img/A01X/G101/ENG/GRM033R60J104KE19-01.pdf; DatasheetVersion: 03/2016; Length: 0.6 mm; Max Operating Temperature: 85 degC; Min Operating Temperature: -55 degC; Mounting Technology: Surface Mount; Package Quantity: 15000; PackageDescription: 2-Pin Surface Mount Device, Body 0.6 x 0.3 mm; Packaging: Tape and Reel; PartNumber: GRM033R60J104KE19D; RoHSCompliant: true; Tolerance: 10%; Width: 0.3 mm; Height: 0.3 mm; Mount: Surface Mount; PackageReference: 0201; Pins: 2; Radiation Hardening: No; REACH SVHC: No SVHC
C311 = E22: Chip Capacitor, 100 nF, +/- 10%, 6.3 V, -55 to 85 degC, 0201 (0603 Metric), RoHS, Tape and Reel; Manufacturer: Basic Passives; Тип элемента: Конденсатор; Capacitance: 100 nF; Case\/Package: 0201; Type (Capacitors): X5R; Voltage Rating: 6.3 V; Voltage Rating (DC): 3 V; Old_des: C464; New_des: C311; UID: E22; Component Kind: Standard; Case Code (Imperial): 0201; Case Code (Metric): 0603; ComponentLink1Description: Manufacturer URL; ComponentLink1URL: http://www.murata.com/; ComponentLink2Description: Datasheet; ComponentLink2URL: http://search.murata.co.jp/Ceramy/image/img/A01X/G101/ENG/GRM033R60J104KE19-01.pdf; DatasheetVersion: 03/2016; Length: 0.6 mm; Max Operating Temperature: 85 degC; Min Operating Temperature: -55 degC; Mounting Technology: Surface Mount; Package Quantity: 15000; PackageDescription: 2-Pin Surface Mount Device, Body 0.6 x 0.3 mm; Packaging: Tape and Reel; PartNumber: GRM033R60J104KE19D; RoHSCompliant: true; Tolerance: 10%; Width: 0.3 mm; Height: 0.3 mm; Mount: Surface Mount; PackageReference: 0201; Pins: 2; Radiation Hardening: No; REACH SVHC: No SVHC
C312 = E22: Chip Capacitor, 100 nF, +/- 10%, 6.3 V, -55 to 85 degC, 0201 (0603 Metric), RoHS, Tape and Reel; Manufacturer: Basic Passives; Тип элемента: Конденсатор; Capacitance: 100 nF; Case\/Package: 0201; Type (Capacitors): X5R; Voltage Rating: 6.3 V; Voltage Rating (DC): 3 V; Old_des: C440; New_des: C312; UID: E22; Component Kind: Standard; Case Code (Imperial): 0201; Case Code (Metric): 0603; ComponentLink1Description: Manufacturer URL; ComponentLink1URL: http://www.murata.com/; ComponentLink2Description: Datasheet; ComponentLink2URL: http://search.murata.co.jp/Ceramy/image/img/A01X/G101/ENG/GRM033R60J104KE19-01.pdf; DatasheetVersion: 03/2016; Length: 0.6 mm; Max Operating Temperature: 85 degC; Min Operating Temperature: -55 degC; Mounting Technology: Surface Mount; Package Quantity: 15000; PackageDescription: 2-Pin Surface Mount Device, Body 0.6 x 0.3 mm; Packaging: Tape and Reel; PartNumber: GRM033R60J104KE19D; RoHSCompliant: true; Tolerance: 10%; Width: 0.3 mm; Height: 0.3 mm; Mount: Surface Mount; PackageReference: 0201; Pins: 2; Radiation Hardening: No; REACH SVHC: No SVHC
C313 = E22: Chip Capacitor, 100 nF, +/- 10%, 6.3 V, -55 to 85 degC, 0201 (0603 Metric), RoHS, Tape and Reel; Manufacturer: Basic Passives; Тип элемента: Конденсатор; Capacitance: 100 nF; Case\/Package: 0201; Type (Capacitors): X5R; Voltage Rating: 6.3 V; Voltage Rating (DC): 3 V; Old_des: C441; New_des: C313; UID: E22; Component Kind: Standard; Case Code (Imperial): 0201; Case Code (Metric): 0603; ComponentLink1Description: Manufacturer URL; ComponentLink1URL: http://www.murata.com/; ComponentLink2Description: Datasheet; ComponentLink2URL: http://search.murata.co.jp/Ceramy/image/img/A01X/G101/ENG/GRM033R60J104KE19-01.pdf; DatasheetVersion: 03/2016; Length: 0.6 mm; Max Operating Temperature: 85 degC; Min Operating Temperature: -55 degC; Mounting Technology: Surface Mount; Package Quantity: 15000; PackageDescription: 2-Pin Surface Mount Device, Body 0.6 x 0.3 mm; Packaging: Tape and Reel; PartNumber: GRM033R60J104KE19D; RoHSCompliant: true; Tolerance: 10%; Width: 0.3 mm; Height: 0.3 mm; Mount: Surface Mount; PackageReference: 0201; Pins: 2; Radiation Hardening: No; REACH SVHC: No SVHC
C314 = E22: Chip Capacitor, 100 nF, +/- 10%, 6.3 V, -55 to 85 degC, 0201 (0603 Metric), RoHS, Tape and Reel; Manufacturer: Basic Passives; Тип элемента: Конденсатор; Capacitance: 100 nF; Case\/Package: 0201; Type (Capacitors): X5R; Voltage Rating: 6.3 V; Voltage Rating (DC): 3 V; Old_des: C442; New_des: C314; UID: E22; Component Kind: Standard; Case Code (Imperial): 0201; Case Code (Metric): 0603; ComponentLink1Description: Manufacturer URL; ComponentLink1URL: http://www.murata.com/; ComponentLink2Description: Datasheet; ComponentLink2URL: http://search.murata.co.jp/Ceramy/image/img/A01X/G101/ENG/GRM033R60J104KE19-01.pdf; DatasheetVersion: 03/2016; Length: 0.6 mm; Max Operating Temperature: 85 degC; Min Operating Temperature: -55 degC; Mounting Technology: Surface Mount; Package Quantity: 15000; PackageDescription: 2-Pin Surface Mount Device, Body 0.6 x 0.3 mm; Packaging: Tape and Reel; PartNumber: GRM033R60J104KE19D; RoHSCompliant: true; Tolerance: 10%; Width: 0.3 mm; Height: 0.3 mm; Mount: Surface Mount; PackageReference: 0201; Pins: 2; Radiation Hardening: No; REACH SVHC: No SVHC
C315 = E22: Chip Capacitor, 100 nF, +/- 10%, 6.3 V, -55 to 85 degC, 0201 (0603 Metric), RoHS, Tape and Reel; Manufacturer: Basic Passives; Тип элемента: Конденсатор; Capacitance: 100 nF; Case\/Package: 0201; Type (Capacitors): X5R; Voltage Rating: 6.3 V; Voltage Rating (DC): 3 V; Old_des: C443; New_des: C315; UID: E22; Component Kind: Standard; Case Code (Imperial): 0201; Case Code (Metric): 0603; ComponentLink1Description: Manufacturer URL; ComponentLink1URL: http://www.murata.com/; ComponentLink2Description: Datasheet; ComponentLink2URL: http://search.murata.co.jp/Ceramy/image/img/A01X/G101/ENG/GRM033R60J104KE19-01.pdf; DatasheetVersion: 03/2016; Length: 0.6 mm; Max Operating Temperature: 85 degC; Min Operating Temperature: -55 degC; Mounting Technology: Surface Mount; Package Quantity: 15000; PackageDescription: 2-Pin Surface Mount Device, Body 0.6 x 0.3 mm; Packaging: Tape and Reel; PartNumber: GRM033R60J104KE19D; RoHSCompliant: true; Tolerance: 10%; Width: 0.3 mm; Height: 0.3 mm; Mount: Surface Mount; PackageReference: 0201; Pins: 2; Radiation Hardening: No; REACH SVHC: No SVHC
C316 = E22: Chip Capacitor, 100 nF, +/- 10%, 6.3 V, -55 to 85 degC, 0201 (0603 Metric), RoHS, Tape and Reel; Manufacturer: Basic Passives; Тип элемента: Конденсатор; Capacitance: 100 nF; Case\/Package: 0201; Type (Capacitors): X5R; Voltage Rating: 6.3 V; Voltage Rating (DC): 3 V; Old_des: C458; New_des: C316; UID: E22; Component Kind: Standard; Case Code (Imperial): 0201; Case Code (Metric): 0603; ComponentLink1Description: Manufacturer URL; ComponentLink1URL: http://www.murata.com/; ComponentLink2Description: Datasheet; ComponentLink2URL: http://search.murata.co.jp/Ceramy/image/img/A01X/G101/ENG/GRM033R60J104KE19-01.pdf; DatasheetVersion: 03/2016; Length: 0.6 mm; Max Operating Temperature: 85 degC; Min Operating Temperature: -55 degC; Mounting Technology: Surface Mount; Package Quantity: 15000; PackageDescription: 2-Pin Surface Mount Device, Body 0.6 x 0.3 mm; Packaging: Tape and Reel; PartNumber: GRM033R60J104KE19D; RoHSCompliant: true; Tolerance: 10%; Width: 0.3 mm; Height: 0.3 mm; Mount: Surface Mount; PackageReference: 0201; Pins: 2; Radiation Hardening: No; REACH SVHC: No SVHC
C317 = E22: Chip Capacitor, 100 nF, +/- 10%, 6.3 V, -55 to 85 degC, 0201 (0603 Metric), RoHS, Tape and Reel; Manufacturer: Basic Passives; Тип элемента: Конденсатор; Capacitance: 100 nF; Case\/Package: 0201; Type (Capacitors): X5R; Voltage Rating: 6.3 V; Voltage Rating (DC): 3 V; Old_des: C463; New_des: C317; UID: E22; Component Kind: Standard; Case Code (Imperial): 0201; Case Code (Metric): 0603; ComponentLink1Description: Manufacturer URL; ComponentLink1URL: http://www.murata.com/; ComponentLink2Description: Datasheet; ComponentLink2URL: http://search.murata.co.jp/Ceramy/image/img/A01X/G101/ENG/GRM033R60J104KE19-01.pdf; DatasheetVersion: 03/2016; Length: 0.6 mm; Max Operating Temperature: 85 degC; Min Operating Temperature: -55 degC; Mounting Technology: Surface Mount; Package Quantity: 15000; PackageDescription: 2-Pin Surface Mount Device, Body 0.6 x 0.3 mm; Packaging: Tape and Reel; PartNumber: GRM033R60J104KE19D; RoHSCompliant: true; Tolerance: 10%; Width: 0.3 mm; Height: 0.3 mm; Mount: Surface Mount; PackageReference: 0201; Pins: 2; Radiation Hardening: No; REACH SVHC: No SVHC
C318 = E22: Chip Capacitor, 100 nF, +/- 10%, 6.3 V, -55 to 85 degC, 0201 (0603 Metric), RoHS, Tape and Reel; Manufacturer: Basic Passives; Тип элемента: Конденсатор; Capacitance: 100 nF; Case\/Package: 0201; Type (Capacitors): X5R; Voltage Rating: 6.3 V; Voltage Rating (DC): 3 V; Old_des: C480; New_des: C318; UID: E22; Component Kind: Standard; Case Code (Imperial): 0201; Case Code (Metric): 0603; ComponentLink1Description: Manufacturer URL; ComponentLink1URL: http://www.murata.com/; ComponentLink2Description: Datasheet; ComponentLink2URL: http://search.murata.co.jp/Ceramy/image/img/A01X/G101/ENG/GRM033R60J104KE19-01.pdf; DatasheetVersion: 03/2016; Length: 0.6 mm; Max Operating Temperature: 85 degC; Min Operating Temperature: -55 degC; Mounting Technology: Surface Mount; Package Quantity: 15000; PackageDescription: 2-Pin Surface Mount Device, Body 0.6 x 0.3 mm; Packaging: Tape and Reel; PartNumber: GRM033R60J104KE19D; RoHSCompliant: true; Tolerance: 10%; Width: 0.3 mm; Height: 0.3 mm; Mount: Surface Mount; PackageReference: 0201; Pins: 2; Radiation Hardening: No; REACH SVHC: No SVHC
C319 = E22: Chip Capacitor, 100 nF, +/- 10%, 6.3 V, -55 to 85 degC, 0201 (0603 Metric), RoHS, Tape and Reel; Manufacturer: Basic Passives; Тип элемента: Конденсатор; Capacitance: 100 nF; Case\/Package: 0201; Type (Capacitors): X5R; Voltage Rating: 6.3 V; Voltage Rating (DC): 3 V; Old_des: C459; New_des: C319; UID: E22; Component Kind: Standard; Case Code (Imperial): 0201; Case Code (Metric): 0603; ComponentLink1Description: Manufacturer URL; ComponentLink1URL: http://www.murata.com/; ComponentLink2Description: Datasheet; ComponentLink2URL: http://search.murata.co.jp/Ceramy/image/img/A01X/G101/ENG/GRM033R60J104KE19-01.pdf; DatasheetVersion: 03/2016; Length: 0.6 mm; Max Operating Temperature: 85 degC; Min Operating Temperature: -55 degC; Mounting Technology: Surface Mount; Package Quantity: 15000; PackageDescription: 2-Pin Surface Mount Device, Body 0.6 x 0.3 mm; Packaging: Tape and Reel; PartNumber: GRM033R60J104KE19D; RoHSCompliant: true; Tolerance: 10%; Width: 0.3 mm; Height: 0.3 mm; Mount: Surface Mount; PackageReference: 0201; Pins: 2; Radiation Hardening: No; REACH SVHC: No SVHC